# Altium project Racequad.PrjPcb
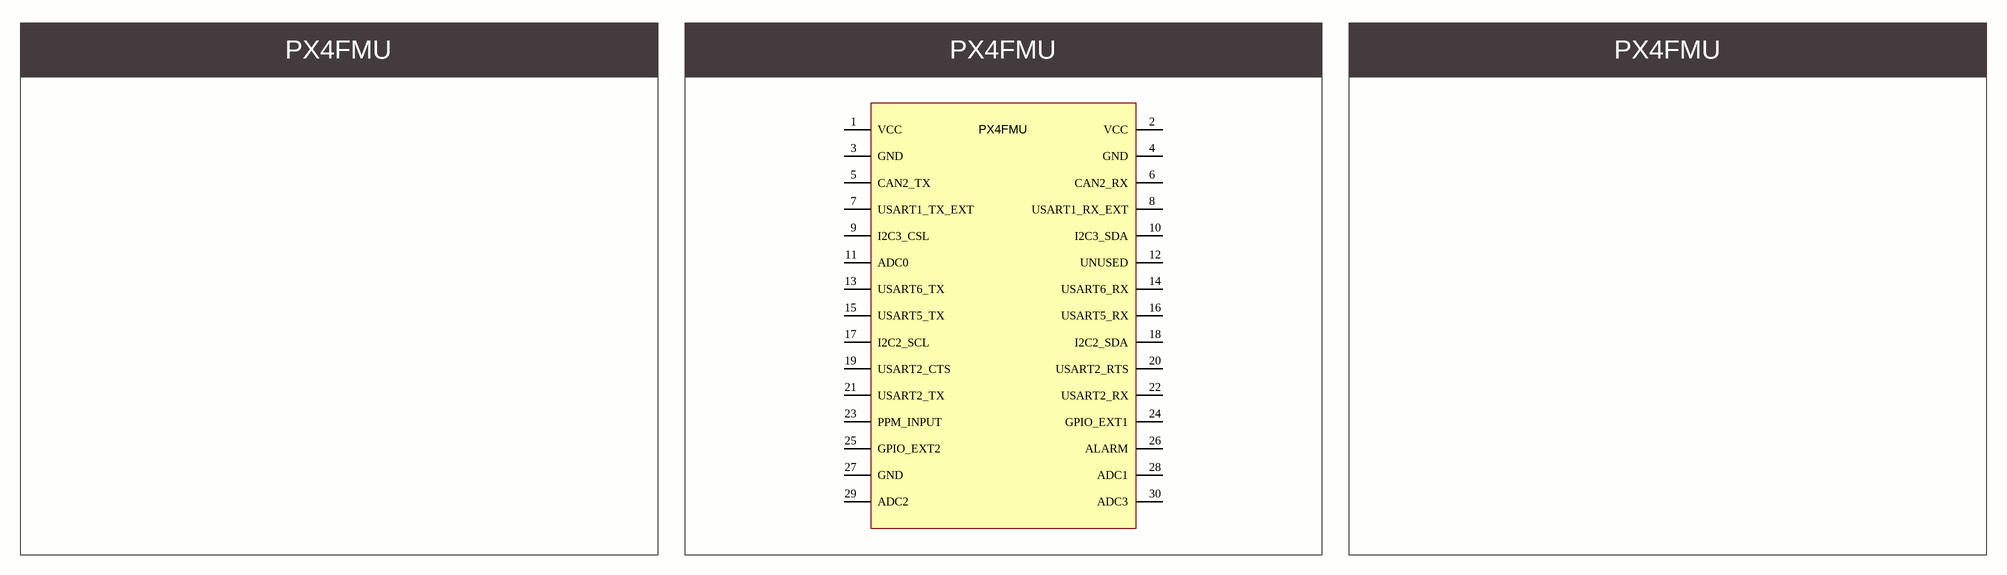
[diagram p0: main.SchDoc]
1 sheet, 1 parts. Net scope: global (net labels, ports and power ports of the same name join across sheets).
Board file: pcb.PcbDoc

## Sheet main.SchDoc
size A3

### Parts
PX4FMU  PX4FMU  (value not drawn)

### Blocks framed on the sheet
PX4FMU: PX4FMU

### Nets

Not connected (* = marked no-connect by the designer): PX4FMU 1(VCC) 2(VCC) 3(GND) 4(GND) 5(CAN2_TX) 6(CAN2_RX) 7(USART1_TX_EXT) 8(USART1_RX_EXT) 9(I2C3_CSL) 10(I2C3_SDA) 11(ADC0) 12(UNUSED) 13(USART6_TX) 14(USART6_RX) 15(USART5_TX) 16(USART5_RX) 17(I2C2_SCL) 18(I2C2_SDA) 19(USART2_CTS) 20(USART2_RTS) 21(USART2_TX) 22(USART2_RX) 23(PPM_INPUT) 24(GPIO_EXT1) 25(GPIO_EXT2) 26(ALARM) 27(GND) 28(ADC1) 29(ADC2) 30(ADC3)

### Notes on the sheet
- PX4FMU

### Library data of the parts
PX4FMU = PX4FMU: PX4FMU flight controller